# Altium schematic sheet IO.SchDoc: RP2040 IO interface
size 420 x 297 mm; Engineer: Hardy Yu, Yuchen Lin, Nelson Mei; DocumentNumber: 3; Revision: A; SheetNumber: 3; SheetTotal: 3; Time: 2024-06-25
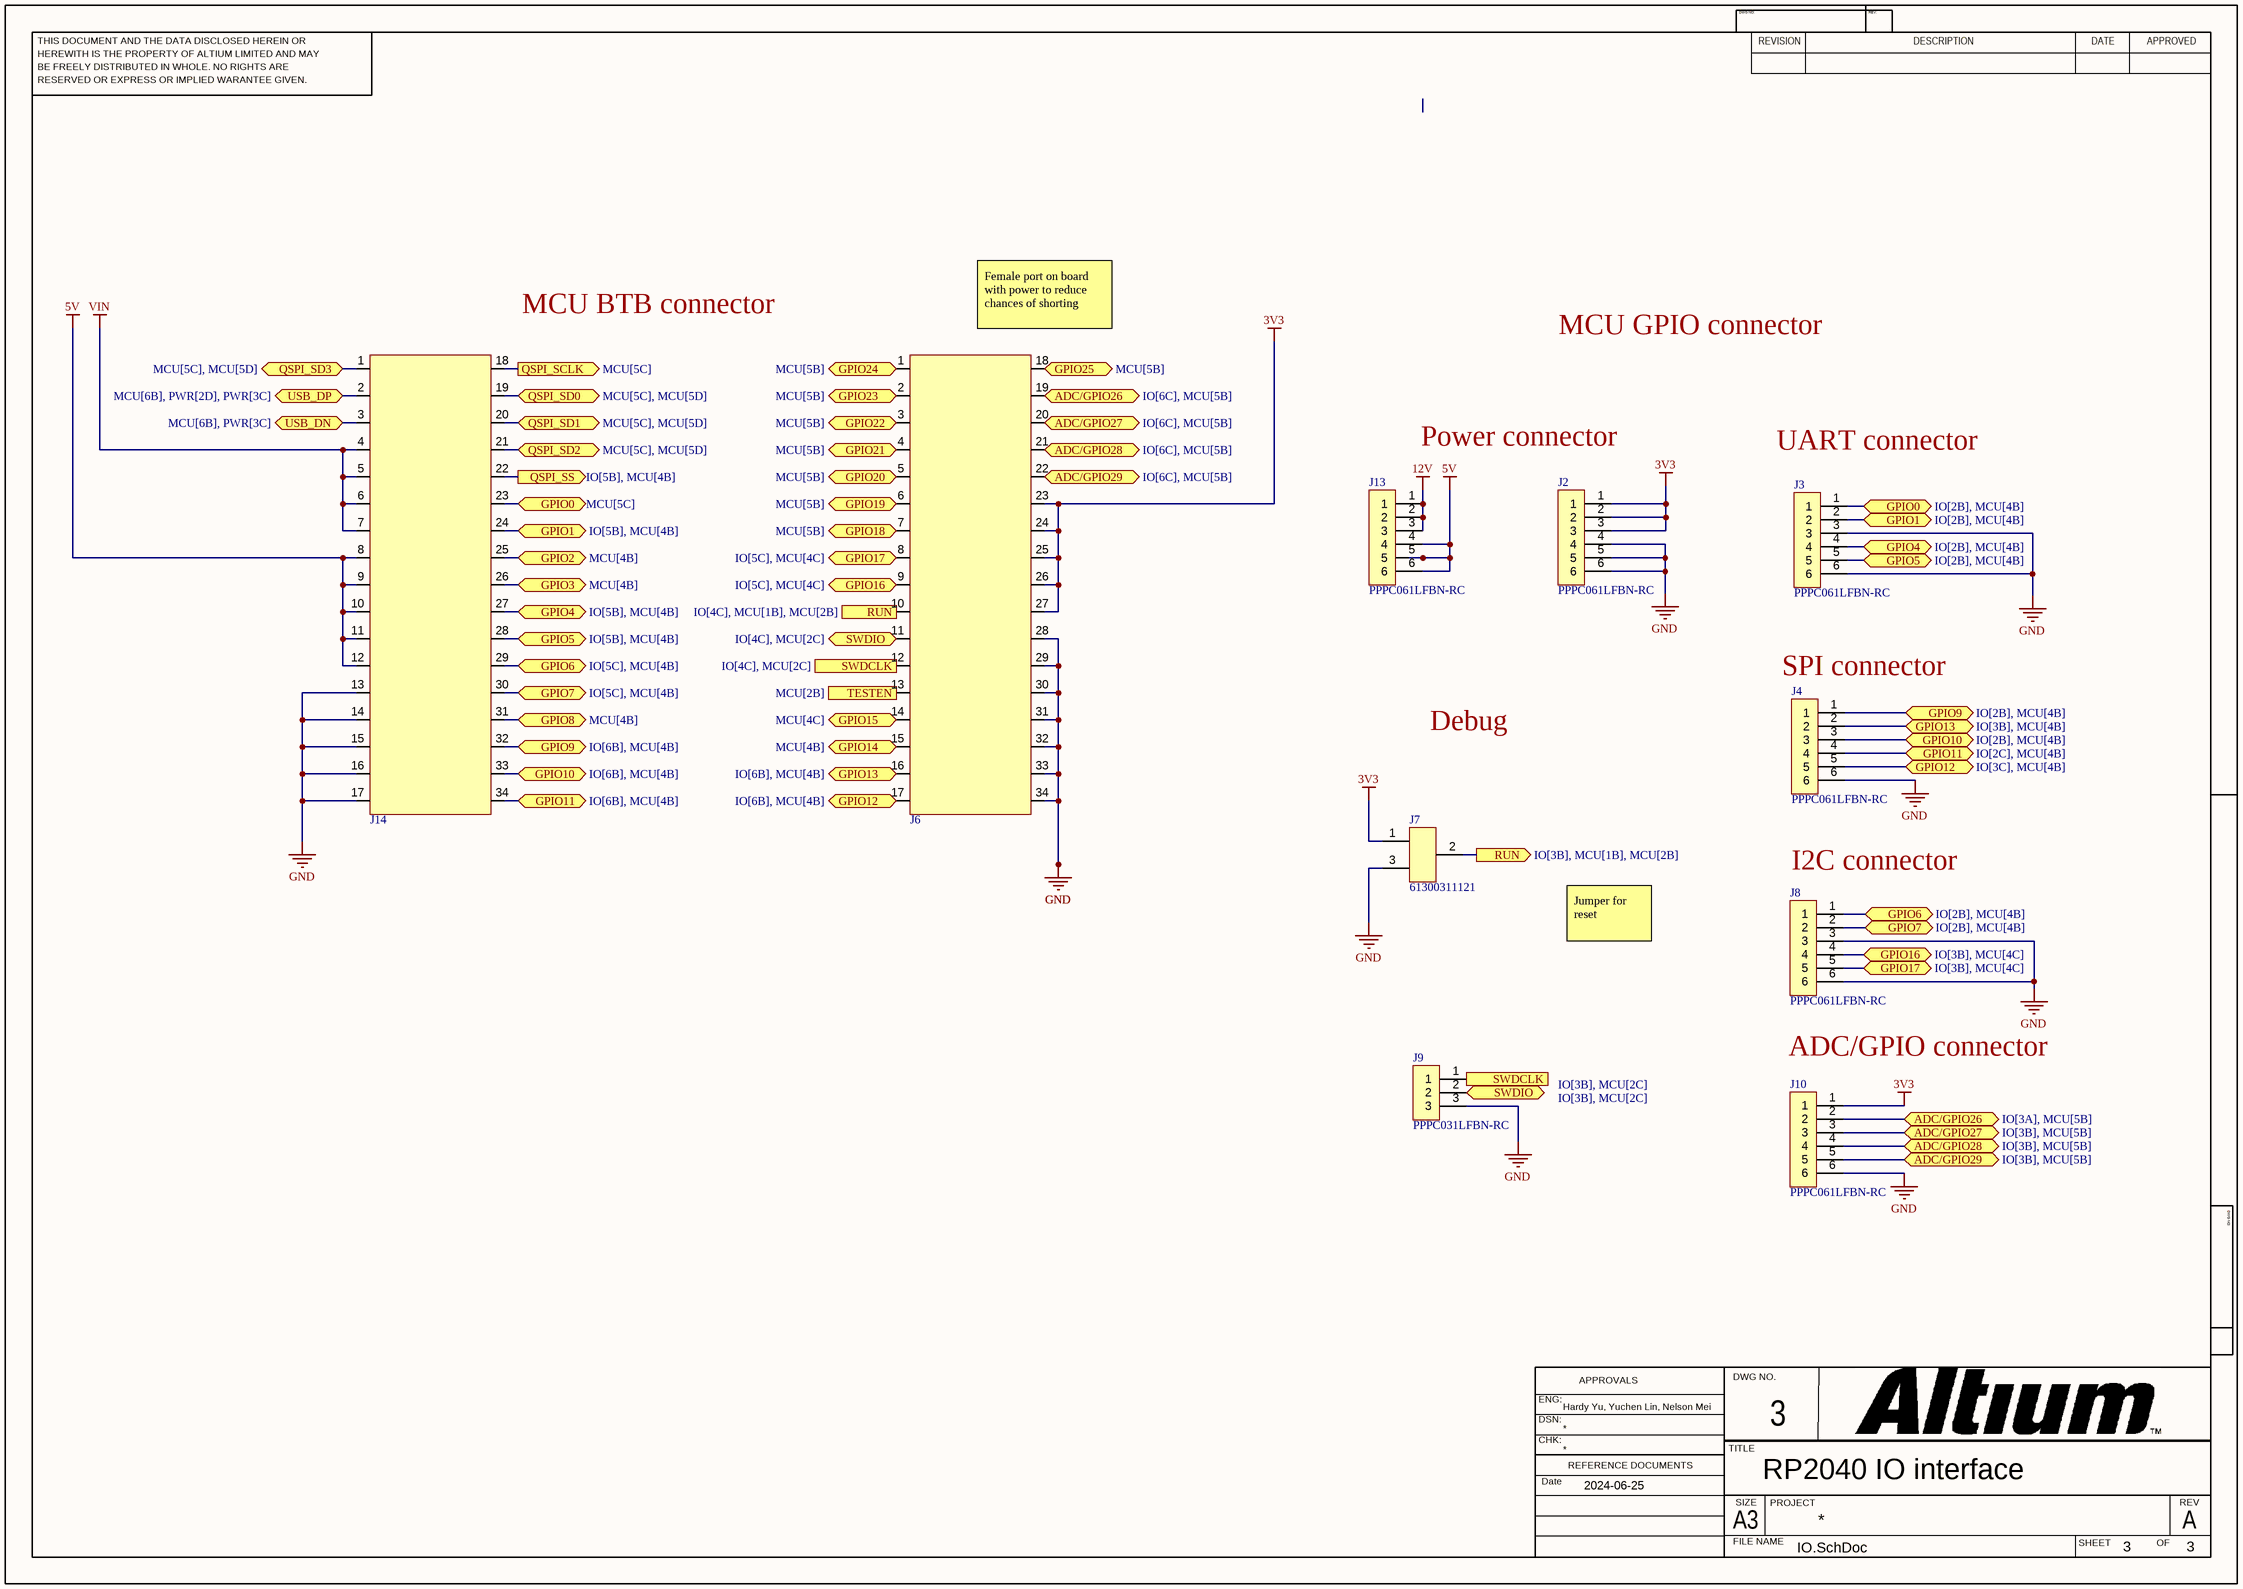
[diagram p0: IO.SchDoc]

## Parts
J2  PPPC061LFBN-RC  [PPPC061LFBN-RC-Footprint-1]
J3  PPPC061LFBN-RC  [PPPC061LFBN-RC-Footprint-1]
J4  PPPC061LFBN-RC  [PPPC061LFBN-RC-Footprint-1]
J6  5054133410  [CON_5054133410_MOL]  (value not drawn)
J7  61300311121  [61300311121]
J8  PPPC061LFBN-RC  [PPPC061LFBN-RC-Footprint-1]
J9  PPPC031LFBN-RC  [PPPC031LFBN-RC-Footprint-1]
J10  PPPC061LFBN-RC  [PPPC061LFBN-RC-Footprint-1]
J13  PPPC061LFBN-RC  [PPPC061LFBN-RC-Footprint-1]
J14  5054133410  [CON_5054133410_MOL]  (value not drawn)

## Ports
ADC/GPIO26 (bidir, see IO[3A], MCU[5B]), ADC/GPIO26 (bidir, see IO[6C], MCU[5B]), ADC/GPIO27 (bidir, see IO[3B], MCU[5B]), ADC/GPIO27 (bidir, see IO[6C], MCU[5B]), ADC/GPIO28 (bidir, see IO[3B], MCU[5B]), ADC/GPIO28 (bidir, see IO[6C], MCU[5B]), ADC/GPIO29 (bidir, see IO[3B], MCU[5B]), ADC/GPIO29 (bidir, see IO[6C], MCU[5B]), GPIO0 (bidir, see IO[2B], MCU[4B]), GPIO0 (bidir, see IO[5B], MCU[4B]), GPIO1 (bidir, see IO[2B], MCU[4B]), GPIO1 (bidir, see IO[5B], MCU[4B]), GPIO2 (bidir, see MCU[4B]), GPIO3 (bidir, see MCU[4B]), GPIO4 (bidir, see IO[2B], MCU[4B]), GPIO4 (bidir, see IO[5B], MCU[4B]), GPIO5 (bidir, see IO[2B], MCU[4B]), GPIO5 (bidir, see IO[5B], MCU[4B]), GPIO6 (bidir, see IO[2B], MCU[4B]), GPIO6 (bidir, see IO[5C], MCU[4B]), GPIO7 (bidir, see IO[2B], MCU[4B]), GPIO7 (bidir, see IO[5C], MCU[4B]), GPIO8 (bidir, see MCU[4B]), GPIO9 (bidir, see IO[2B], MCU[4B]), GPIO9 (bidir, see IO[6B], MCU[4B]), GPIO10 (bidir, see IO[2B], MCU[4B]), GPIO10 (bidir, see IO[6B], MCU[4B]), GPIO11 (bidir, see IO[2C], MCU[4B]), GPIO11 (bidir, see IO[6B], MCU[4B]), GPIO12 (bidir, see IO[3C], MCU[4B]), GPIO12 (bidir, see IO[6B], MCU[4B]), GPIO13 (bidir, see IO[3B], MCU[4B]), GPIO13 (bidir, see IO[6B], MCU[4B]), GPIO14 (bidir, see MCU[4B]), GPIO15 (bidir, see MCU[4C]), GPIO16 (bidir, see IO[3B], MCU[4C]), GPIO16 (bidir, see IO[5C], MCU[4C]), GPIO17 (bidir, see IO[3B], MCU[4C]), GPIO17 (bidir, see IO[5C], MCU[4C]), GPIO18 (bidir, see MCU[5B]), GPIO19 (bidir, see MCU[5B]), GPIO20 (bidir, see MCU[5B]), GPIO21 (bidir, see MCU[5B]), GPIO22 (bidir, see MCU[5B]), GPIO23 (bidir, see MCU[5B]), GPIO24 (bidir, see MCU[5B]), GPIO25 (bidir, see MCU[5B]), QSPI_SCLK (out, see MCU[5C]), QSPI_SD0 (bidir, see MCU[5C], MCU[5D]), QSPI_SD1 (bidir, see MCU[5C], MCU[5D]), QSPI_SD2 (bidir, see MCU[5C], MCU[5D]), QSPI_SD3 (bidir, see MCU[5C], MCU[5D]), QSPI_SS (out, see MCU[5C]), RUN (out, see IO[3B], MCU[1B], MCU[2B]), RUN (out, see IO[4C], MCU[1B], MCU[2B]), SWDCLK (out, see IO[3B], MCU[2C]), SWDCLK (out, see IO[4C], MCU[2C]), SWDIO (bidir, see IO[3B], MCU[2C]), SWDIO (bidir, see IO[4C], MCU[2C]), TESTEN (out, see MCU[2B]), USB_DN (bidir, see MCU[6B], PWR[3C]), USB_DP (bidir, see MCU[6B], PWR[2D], PWR[3C])

## Nets
3V3: J2.1 J2.2 J2.3 J6.23 J6.24 J6.25 J6.26 J6.27 J7.1 J10.1
5V: J13.4 J13.5 J13.6 J14.8 J14.9 J14.10 J14.11 J14.12
12V: J13.1 J13.2 J13.3
GND: J2.4 J2.5 J2.6 J3.3 J3.6 J4.6 J6.28 J6.29 J6.30 J6.31 J6.32 J6.33 J6.34 J7.3 J8.3 J8.6 J9.3 J10.6 J14.13 J14.14 J14.15 J14.16 J14.17
VIN: J14.4 J14.5 J14.6 J14.7
ADC/GPIO26: J6.19 J10.2 ; port ADC/GPIO26
ADC/GPIO27: J6.20 J10.3 ; port ADC/GPIO27
ADC/GPIO28: J6.21 J10.4 ; port ADC/GPIO28
ADC/GPIO29: J6.22 J10.5 ; port ADC/GPIO29
GPIO0: J3.1 J14.23 ; port GPIO0
GPIO1: J3.2 J14.24 ; port GPIO1
GPIO2: J14.25 ; port GPIO2
GPIO3: J14.26 ; port GPIO3
GPIO4: J3.4 J14.27 ; port GPIO4
GPIO5: J3.5 J14.28 ; port GPIO5
GPIO6: J8.1 J14.29 ; port GPIO6
GPIO7: J8.2 J14.30 ; port GPIO7
GPIO8: J14.31 ; port GPIO8
GPIO9: J4.1 J14.32 ; port GPIO9
GPIO10: J4.3 J14.33 ; port GPIO10
GPIO11: J4.4 J14.34 ; port GPIO11
GPIO12: J4.5 J6.17 ; port GPIO12
GPIO13: J4.2 J6.16 ; port GPIO13
GPIO14: J6.15 ; port GPIO14
GPIO15: J6.14 ; port GPIO15
GPIO16: J6.9 J8.4 ; port GPIO16
GPIO17: J6.8 J8.5 ; port GPIO17
GPIO18: J6.7 ; port GPIO18
GPIO19: J6.6 ; port GPIO19
GPIO20: J6.5 ; port GPIO20
GPIO21: J6.4 ; port GPIO21
GPIO22: J6.3 ; port GPIO22
GPIO23: J6.2 ; port GPIO23
GPIO24: J6.1 ; port GPIO24
GPIO25: J6.18 ; port GPIO25
QSPI_SCLK: J14.18 ; port QSPI_SCLK
QSPI_SD0: J14.19 ; port QSPI_SD0
QSPI_SD1: J14.20 ; port QSPI_SD1
QSPI_SD2: J14.21 ; port QSPI_SD2
QSPI_SD3: J14.1 ; port QSPI_SD3
QSPI_SS: J14.22 ; port QSPI_SS
RUN: J6.10 J7.2 ; port RUN
SWDCLK: J6.12 J9.1 ; port SWDCLK
SWDIO: J6.11 J9.2 ; port SWDIO
TESTEN: J6.13 ; port TESTEN
USB_DN: J14.3 ; port USB_DN
USB_DP: J14.2 ; port USB_DP

## Notes on the sheet
- MCU BTB connector
- (near J6) Female port on board with power to reduce chances of shorting
- MCU GPIO connector
- Power connector
- (near J3) UART connector
- Debug
- (near J4) SPI connector
- Jumper for reset
- (near J8) I2C connector
- ADC/GPIO connector
- THIS DOCUMENT AND THE DATA DISCLOSED HEREIN OR
- HEREWITH IS THE PROPERTY OF ALTIUM LIMITED AND MAY
- DWG NO:
- REVISION
- REV:
- DESCRIPTION
- DATE
- APPROVED
- BE FREELY DISTRIBUTED IN WHOLE. NO RIGHTS ARE
- RESERVED OR EXPRESS OR IMPLIED WARANTEE GIVEN.
- ENG:
- APPROVALS
- DWG NO.
- DSN:
- CHK:
- REFERENCE DOCUMENTS
- TITLE
- Date
- A3
- FILE NAME
- SIZE
- PROJECT
- SHEET
- OF
- REV

## Library data of the parts
J2-J4 J8 J10 J13 = CMP-002-00004-4: CONN HEADER 6X1 2.54MM FEMALE VERT TH; Manufacturer: Sullins Connector Solutions; Supplier: Digikey; Pitch: 2.54mm; Supplier Part Number: S7039-ND; Manufacturer P/N: PPPC061LFBN-RC
J6 J14 = 5054133410: 34 Position Connector Receptacle, Center Strip Contacts Surface Mount Gold; Manufacture: Molex; # of rows: 2; ComponentLink1Description: digitkey; ComponentLink1URL: https://www.digikey.ca/en/products/detail/molex/5054133410/6822630
J7 = 61300311121: CONN HEADER VERT 3POS 2.54MM; Number of positions: 3; Connector Type: Header; Contact Type: Male Pin
J9 = CMP-002-00001-4: CONN HEADER 3X1 2.54MM FEMALE VERT TH; Manufacturer: Sullins Connector Solutions; Pitch: 2.54mm; Supplier Part Number: S7036-ND; Manufacturer P/N: PPPC031LFBN-RC; Supplier: Digikey